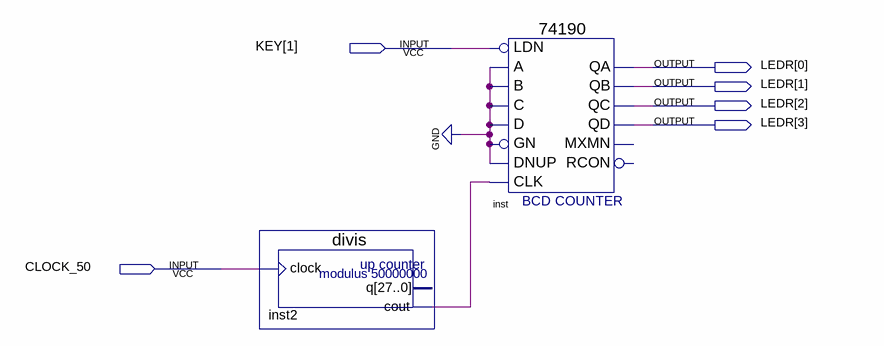
[diagram p0: schematic sheet]
// Quartus schematic esquematico.bdf as structural Verilog: 2 symbols, 6 pins
module esquematico (
  input  [1:1] KEY,
  input  CLOCK_50,
  output [3:0] LEDR
);

  wire inst2_cout;

  divis inst2 (.clock(CLOCK_50), .cout(inst2_cout));  // open: q
  \74190  inst (
    .LDN(KEY[1]), .A(1'b0), .C(1'b0), .B(1'b0), .D(1'b0), .GN(1'b0), .CLK(inst2_cout), .DNUP(1'b0),
    .QA(LEDR[0]), .QB(LEDR[1]), .QD(LEDR[3]), .QC(LEDR[2]));  // open: MXMN, RCON
endmodule
